# EAGLE design Key (EAGLE 6.5.0)
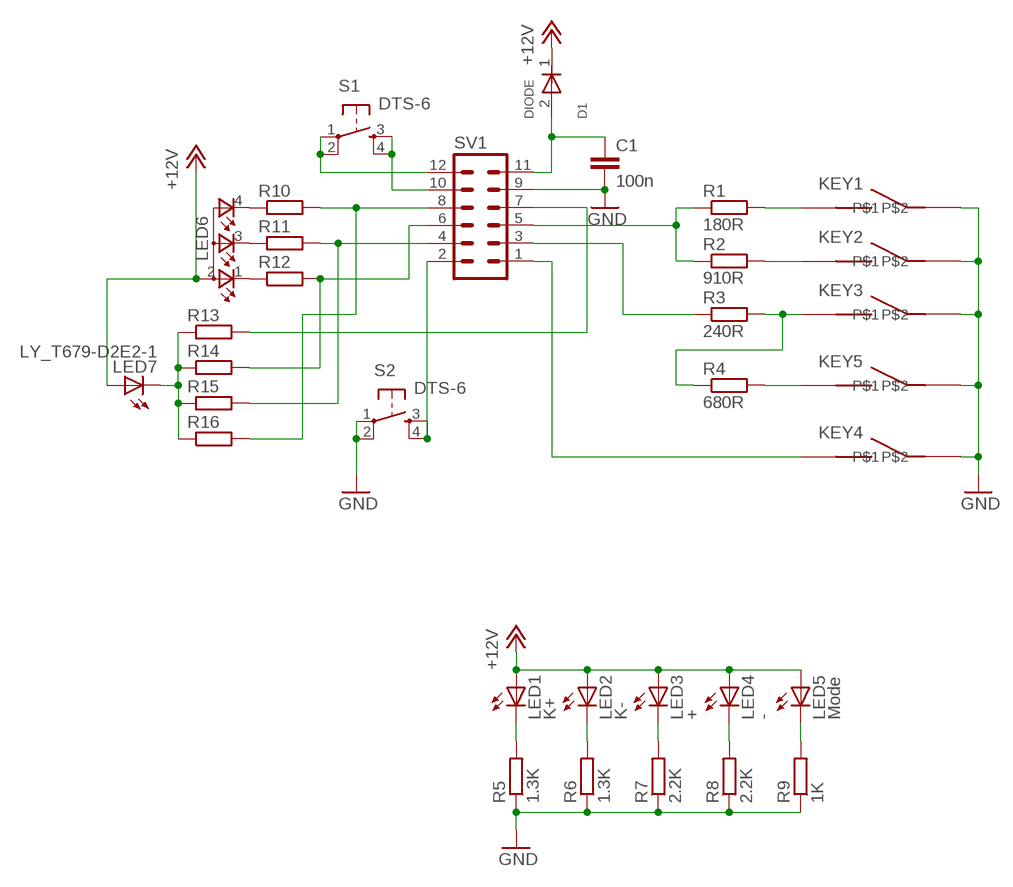
[diagram p0: schematic, sheet 1]

## Parts
C1  100n  C-EUC0805K  [C0805K]
D1  DIODE  [SOD80]
KEY1  PRINT_KEYPRINTED-KEY  [PRINT_KEY]
KEY2  PRINT_KEYPRINTED-KEY  [PRINT_KEY]
KEY3  PRINT_KEYPRINTED-KEY  [PRINT_KEY]
KEY4  PRINT_KEYPRINTED-KEY  [PRINT_KEY]
KEY5  PRINT_KEYPRINTED-KEY  [PRINT_KEY]
LED1  K+  LY_T679-D2E2-1  [PLCC2]
LED2  K-  LY_T679-D2E2-1  [PLCC2]
LED3  +  LY_T679-D2E2-1  [PLCC2]
LED4  -  LY_T679-D2E2-1  [PLCC2]
LED5  Mode  LY_T679-D2E2-1  [PLCC2]
LED6  TOPLED-3  [P-LCC-4-3]
LED7  LY_T679-D2E2-1  [PLCC2]
R1  180R  R-EU_R1206  [R1206]
R2  910R  R-EU_R1206  [R1206]
R3  240R  R-EU_R1206  [R1206]
R4  680R  R-EU_R1206  [R1206]
R5  1.3K  R-EU_R1206  [R1206]
R6  1.3K  R-EU_R1206  [R1206]
R7  2.2K  R-EU_R1206  [R1206]
R8  2.2K  R-EU_R1206  [R1206]
R9  1K  R-EU_R1206  [R1206]
R10  R-EU_R0603  [R0603]
R11  R-EU_R0603  [R0603]
R12  R-EU_R0603  [R0603]
R13  R-EU_R0603  [R0603]
R14  R-EU_R0603  [R0603]
R15  R-EU_R0603  [R0603]
R16  R-EU_R0603  [R0603]
S1  DTS-6  [DTS-6]
S2  DTS-6  [DTS-6]
SV1  MA06-2  [MA06-2]

## Nets
+12V: D1.1(KATOD) LED1.A LED2.A LED3.A LED4.A LED5.A LED6.2(A2) LED7.A
GND: C1.2 KEY1.P$2 KEY2.P$2 KEY3.P$2 KEY4.P$2 KEY5.P$2 R5.1 R6.1 R7.1 R8.1 R9.1 S2.1 S2.2 SV1.9
N$1: C1.1 D1.2(ANOD) SV1.11
N$2: R1.1 R2.1 SV1.5
N$3: KEY1.P$1 R1.2
N$4: KEY2.P$1 R2.2
N$5: R3.1 SV1.3
N$6: KEY3.P$1 R3.2 R4.1
N$7: LED1.C R5.2
N$8: KEY5.P$1 R4.2
N$9: KEY4.P$1 SV1.1
N$10: LED2.C R6.2
N$11: LED3.C R7.2
N$12: LED4.C R8.2
N$13: LED5.C R9.2
N$14: S2.3 S2.4 SV1.2
N$15: LED6.4(CGREEN) R10.1
N$16: LED6.3(CBLUE) R11.1
N$17: LED6.1(CRED) R12.1
N$18: R11.2 R15.2 SV1.4
N$19: R12.2 R14.2 SV1.6
N$20: R10.2 R16.2 SV1.8
N$21: S1.3 S1.4 SV1.10
N$22: S1.1 S1.2 SV1.12
N$25: LED7.C R13.1 R14.1 R15.1 R16.1
N$26: R13.2 SV1.7

## Library data of the parts
C1 = rcl:C-EU: CAPACITOR, European symbol
D1 = usb:DIODE: DIODE
KEY1-KEY5 = usb:PRINT_KEY
LED1-LED5 LED7 = led:*_T679-?-1: LC TOPLED® Low Current LED Source: http://catalog.osram-os.com .. LG_LS_LY_T679_OBS.pdf; COLOR: yellow
LED6 = led:TOPLED-3: OSRAM - Hyper Multi TOPLED® (RGB) LB E673, LV E673, LT E673 - Power TOPLED® Enhanced optical Power LED (HOP2000) LS E67B, LA E67B, LO E67B, LY E67B - Hyper Multi TOPLED® Enhanced optical Power LED (HOP2000 / ATON®) LATB T66B - Hyper Multi TOPLED® Hyper-Bright LED LATB T686 Source: http://www.osram.convergy.de/
R1-R16 = rcl:R-EU_: RESISTOR, European symbol
S1 S2 = switch-tact:DTS-6
SV1 = con-lstb:MA06-2: PIN HEADER; OC_FARNELL: unknown; OC_NEWARK: unknown

## Board
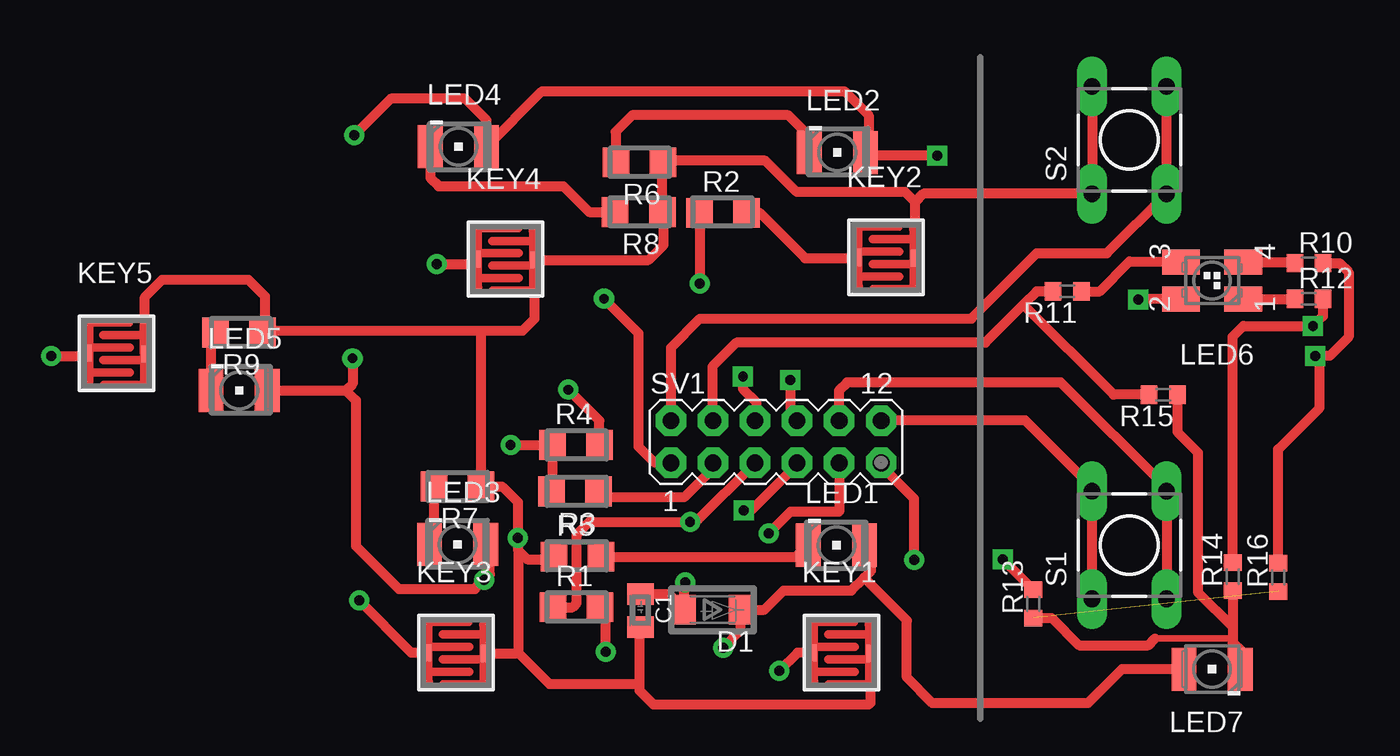
[diagram p1: board, top side]
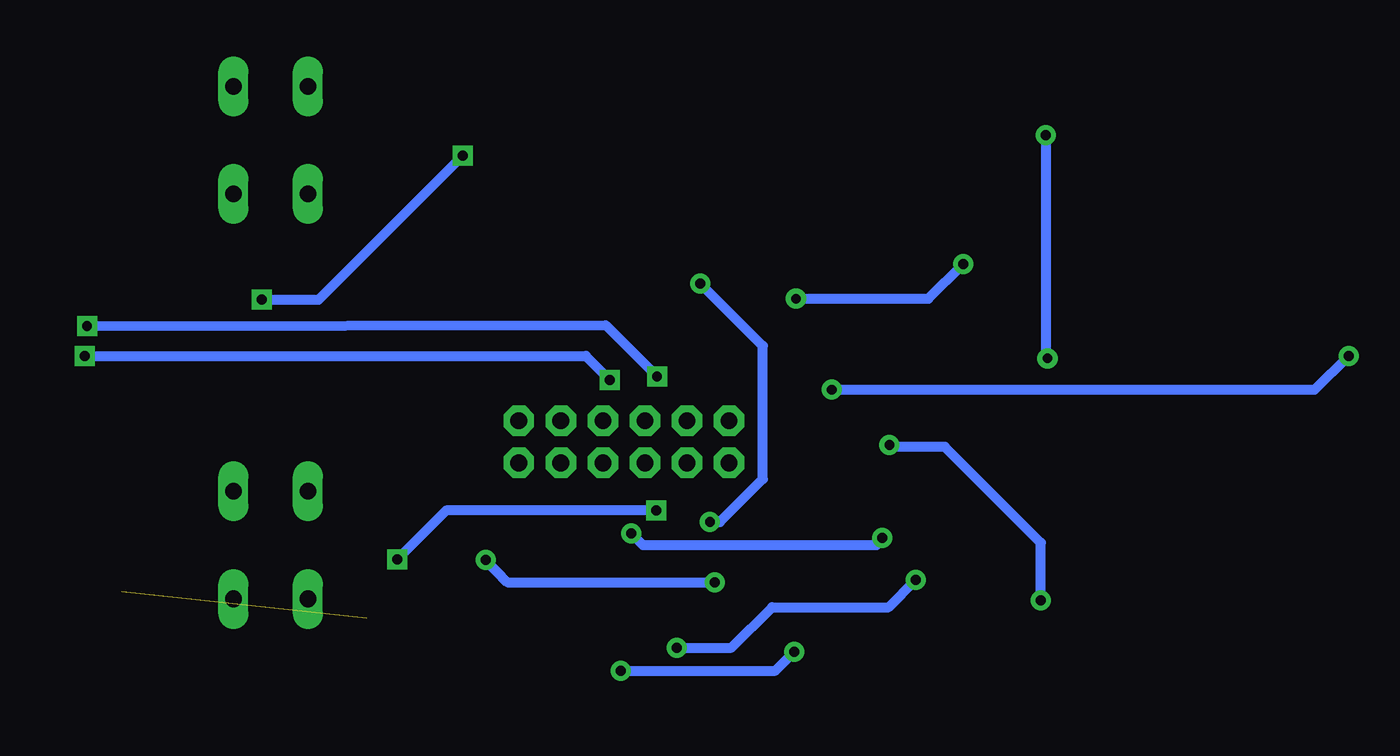
[diagram p2: board, bottom side, seen from below]

No outline drawn. Coordinates in mm, seen from the top.
Copper layers (1*16): Top 0.035mm / dielectric 1.5mm / Bottom 0.035mm
Design rules "default": minimum track width 12mil, minimum drill 32mil, track to track 12mil, track to pad 12mil, pad to pad 12mil, via to via 12mil, smd to smd 8mil, copper to edge 40mil, drill to drill 8mil, minimum pad ring 16mil, minimum via ring 12mil, stop-mask expansion 4mil, vias tented up to drill 0mil, thermal gap 20mil

### Footprints (pad centres in the part's own frame; a part is rotated, then mirrored left to right if it is on the bottom)
C0805K = smd 1.3 x 1.6: 1 -1,0; 2 1,0
SOD80 = smd 1.4 x 1.8: 1 -1.7,0; 2 1.7,0
PRINT_KEY = smd 0.508 x 1.016: P$1 0.25,2; P$2 3.75,1.95
PLCC2 = smd 2.6 x 1.5: A 0,1.7; C 0,-1.7
P-LCC-4-3 = smd 1.524 x 2.286: 1 -1.111,-1.88; 2 -1.111,1.88; 3 1.111,1.88; 4 1.111,-1.88
R1206 = smd 1.6 x 1.803: 1 -1.422,0; 2 1.422,0
R0603 = smd 1 x 1.1: 1 -0.85,0; 2 0.85,0
DTS-6 = drill 1 long: 1 -3.25,2.25; 2 3.25,2.25; 3 -3.25,-2.25; 4 3.25,-2.25
MA06-2 = drill 1.016 octagon: 1 -6.35,-1.27; 2 -6.35,1.27; 3 -3.81,-1.27; 4 -3.81,1.27; 5 -1.27,-1.27; 6 -1.27,1.27; 7 1.27,-1.27; 8 1.27,1.27; 9 3.81,-1.27; 10 3.81,1.27; 11 6.35,-1.27; 12 6.35,1.27

### Placement (x,y rotation side)
C1  37.45,6.55 270 top
D1  41.8,6.6 180 top
KEY1  47.6,2 0 top
KEY2  50.3,25.9 0 top
KEY3  24.3,2 0 top
KEY4  27.3,25.8 0 top
KEY5  3.8,20.1 0 top
LED1  49.3,10.5 270 top
LED2  49.35,34.25 270 top
LED3  26.4,10.55 270 top
LED4  26.45,34.6 270 top
LED5  13.2,19.85 270 top
LED6  72,26.5 90 top
LED7  72,3 90 top
R1  33.6,6.75 0 top
R2  42.45,30.6 0 top
R3  33.5,13.75 180 top
R4  33.55,16.55 0 top
R5  33.65,9.8 0 top
R6  37.4,33.65 180 top
R7  26.4,14.05 180 top
R8  37.35,30.65 180 top
R9  13.2,23.35 180 top
R10  77.85,27.55 0 top
R11  63.25,25.85 180 top
R12  77.85,25.4 0 top
R13  61.2,6.95 90 top
R14  73.25,8.6 90 top
R15  69.05,19.6 180 top
R16  76,8.55 90 top
S1  67,10.5 90 top
S2  67,35 90 top
SV1  45.65,16.75 0 top

### Tracks (layer width: path | path; a pad name or v marks a point on that pad's centre or on a via)
+12V  (via drill 0.6)
  Top 0.6: LED2.A 51.25,34.4 51.25,36.5 49.8,37.95 31.5,37.95 LED4.A 28.15,36.2 26.85,37.5 22.35,37.5 v20.15,35.3 | LED5.A 19.65,19.85 | 19.65,19.85 20.25,19.25 20.25,10.45 22.85,7.85 27.45,7.85 v28,8.4 28.35,8.75 28.35,10.35 LED3.A | v20.05,21.8 20.05,20.25 19.65,19.85 | LED1.A 51.4,10.15 51.4,8.95 50.98,8.53 50.2,7.75 46.1,7.75 44.95,6.6 D1.1 43.5,5.35 v42.45,4.3
  Top 0.61: LED6.2 67.59,25.39 v67.55,25.35 | v55.4,34.05 51.25,34.05 LED2.A | 50.98,8.53 53.55,5.95 53.55,2.5 55.1,0.95 64.5,0.95 66.55,3 LED7.A
  Bottom 0.6: v20.15,35.3 20.15,21.9 v20.05,21.8 | v42.45,4.3 39.15,4.3 36.7,6.75 29.65,6.75 v28,8.4
  Bottom 0.61: v67.55,25.35 64.1,25.35 v55.4,34.05
GND  (via drill 0.6)
  Top 0.6: KEY5.P$2 7.5,22.05 7.5,25.5 8.55,26.55 13.75,26.55 14.75,25.55 14.75,23.48 | 14.75,23.48 R9.1 | 14.75,23.48 27.85,23.48 | 27.85,23.48 30.33,23.48 31.05,24.2 KEY4.P$2 37.95,27.75 38.85,28.65 38.85,30.57 R8.1 38.77,33.6 R6.1 38.92,33.75 45,33.75 46.9,31.85 53.45,31.85 54.05,31.25 KEY2.P$2 | KEY1.P$2 51.35,0.95 51.25,0.85 38.25,0.85 37.4,1.7 37.4,2.1 | 37.4,2.1 37.4,5.5 C1.2 | KEY3.P$2 30.1,3.95 | 30.1,3.95 31.95,2.1 37.4,2.1 | 27.85,23.48 27.82,23.45 R7.1 29.1,14.05 30.05,13.1 v30.05,10.95 30.05,10.2 30.1,10.15 | 30.1,10.15 30.6,9.65 32.08,9.65 R5.1 | 30.1,3.95 30.1,10.15 | SV1.9 49.46,12.51 46.51,12.51 v45.2,11.2
  Top 0.61: 54.05,31.25 54.55,31.75 S2.1 S2.2
  Bottom 0.6: v45.2,11.2 44.5,10.5 30.4,10.5 30.05,10.85 v30.05,10.95
N$1  (via drill 0.6)
  Top 0.6: C1.1 39.15,7.55 D1.2 40.1,8.2 v40.15,8.25 | v54,9.6 54,13.3 51.95,15.35 51.95,15.43 SV1.11
  Bottom 0.6: 40.15,8.5 v40.15,8.25 52.7,8.25 v54,9.6
N$2  (via drill 0.6)
  Top 0.6: R2.1 v41.03,26.33 | R1.1 33.35,6.75 33.6,7 33.6,11.15 34.35,11.9 v40.45,11.9 40.8,11.9 SV1.5
  Bottom 0.6: v41.03,26.33 37.25,22.55 37.25,14.5 39.85,11.9 v40.45,11.9
N$3  (via drill 0.6)
  Top 0.6: KEY1.P$1 46.95,4 v45.85,2.9 | v35.35,4.05 35.35,6.42 R1.2
  Bottom 0.6: v45.85,2.9 36.5,2.9 v35.35,4.05
N$4
  Top 0.6: R2.2 44.65,30.6 47.4,27.85 50.5,27.85 KEY2.P$1
N$5
  Top 0.6: SV1.3 41.84,15.14 40.1,13.4 35.27,13.4 R3.1
N$6  (via drill 0.6)
  Top 0.6: R3.2 32.13,13.8 R4.1 v29.6,16.55 | KEY3.P$1 23.6,4 v20.45,7.15
  Bottom 0.6: 29.55,16.6 v29.6,16.55 29.5,16.45 26.25,16.45 20.45,10.65 v20.45,7.15
N$7
  Top 0.6: R5.2 46.85,9.8 LED1.C
N$8  (via drill 0.6)
  Top 0.6: R4.2 34.97,18.03 v33.1,19.9 | v1.85,21.95 3.9,21.95 KEY5.P$1
  Bottom 0.6: v33.1,19.9 3.9,19.9 v1.85,21.95
N$9  (via drill 0.6)
  Top 0.6: SV1.1 38.32,15.48 37.35,16.45 37.35,23.3 v35.25,25.4 | v25.15,27.5 27.25,27.5 KEY4.P$1
  Bottom 0.6: v35.25,25.4 27.25,25.4 v25.15,27.5
N$10
  Top 0.6: LED2.C 47.6,35.3 46.4,36.5 36.95,36.5 35.95,35.5 35.95,33.68 R6.2
N$11
  Top 0.61: LED3.C 24.98,10.55 R7.2
N$12
  Top 0.6: LED4.C 24.75,32.7 25.25,32.2 32.8,32.2 34.35,30.65 R8.2
N$13
  Top 0.6: LED5.C 11.5,23.07 R9.2
N$14
  Top 0.61: S2.4 S2.3 65.65,28.15 61.4,28.15 57.45,24.2 41.05,24.2 39.3,22.45 SV1.2
N$15
  Top 0.61: LED6.4 76.94,27.61 R10.1
N$16
  Top 0.61: R11.1 65.2,25.85 67,27.65 70.08,27.65 LED6.3
N$17
  Top 0.61: LED6.1 76.99,25.39 R12.1
N$18
  Top 0.61: R11.2 61.4,25.85 60.6,25.05 | 60.6,25.05 58.3,22.75 43.25,22.75 41.8,21.3 41.8,18.06 SV1.4 | R15.2 66.05,19.6 60.6,25.05
N$19  (via drill 0.6)
  Top 0.61: R12.2 78.7,24.35 v78.1,23.75 v78.09,23.76 73.9,23.76 73.25,23.11 R14.2 | v43.65,20.7 43.65,19.95 44.45,19.15 44.45,18.09 SV1.6
  Bottom 0.61: v78.1,23.75 46.75,23.8 v43.65,20.7
N$20  (via drill 0.6)
  Top 0.61: R10.2 79.7,27.55 80.25,27 80.25,23.1 79.1,21.95 v78.25,21.95 | 78.2,21.95 v78.25,21.95 | v46.5,20.5 46.5,18.44 SV1.8 | R16.2 76,16.3 78.5,18.8 78.5,21.7 v78.25,21.95
  Bottom 0.61: v78.25,21.95 47.95,21.95 v46.5,20.5
N$21
  Top 0.61: S1.3 S1.4 69.25,13.95 62.85,20.35 49.95,20.35 49.45,19.85 SV1.10
N$22
  Top 0.61: S1.1 S1.2 64.75,14 60.7,18.05 52.03,18.05 SV1.12
N$25  (1 unrouted)
  Top 0.406: 68.55,4.85 73,4.85 73.75,4.1 73.75,3.05 LED7.C
  Top 0.61: R13.1 62.3,6.1 63.95,4.45 68.15,4.45 68.55,4.85 | R14.1 73.25,5.55 | 73.25,5.55 73.25,4.6 73.75,4.1 | R15.1 69.9,17.35 71.15,16.1 71.15,7.65 73.25,5.55
N$26  (via drill 0.6)
  Top 0.61: SV1.7 46.92,15.37 44.2,12.65 43.75,12.65 v43.7,12.6 | v59.35,9.65 R13.2
  Bottom 0.61: v43.7,12.6 56.4,12.6 v59.35,9.65

### Text on the board
tDocu: 222 | 132 | 132 | 222 | 911 | 4 | 2 | 102 | 5 | 102 | 681 | 222 | 241 | 222 | 132 | 132 | 181 | 3 | 1